# EAGLE design IO Board (EAGLE 9.5.0)

## Sheet 1 of 3: IO Control
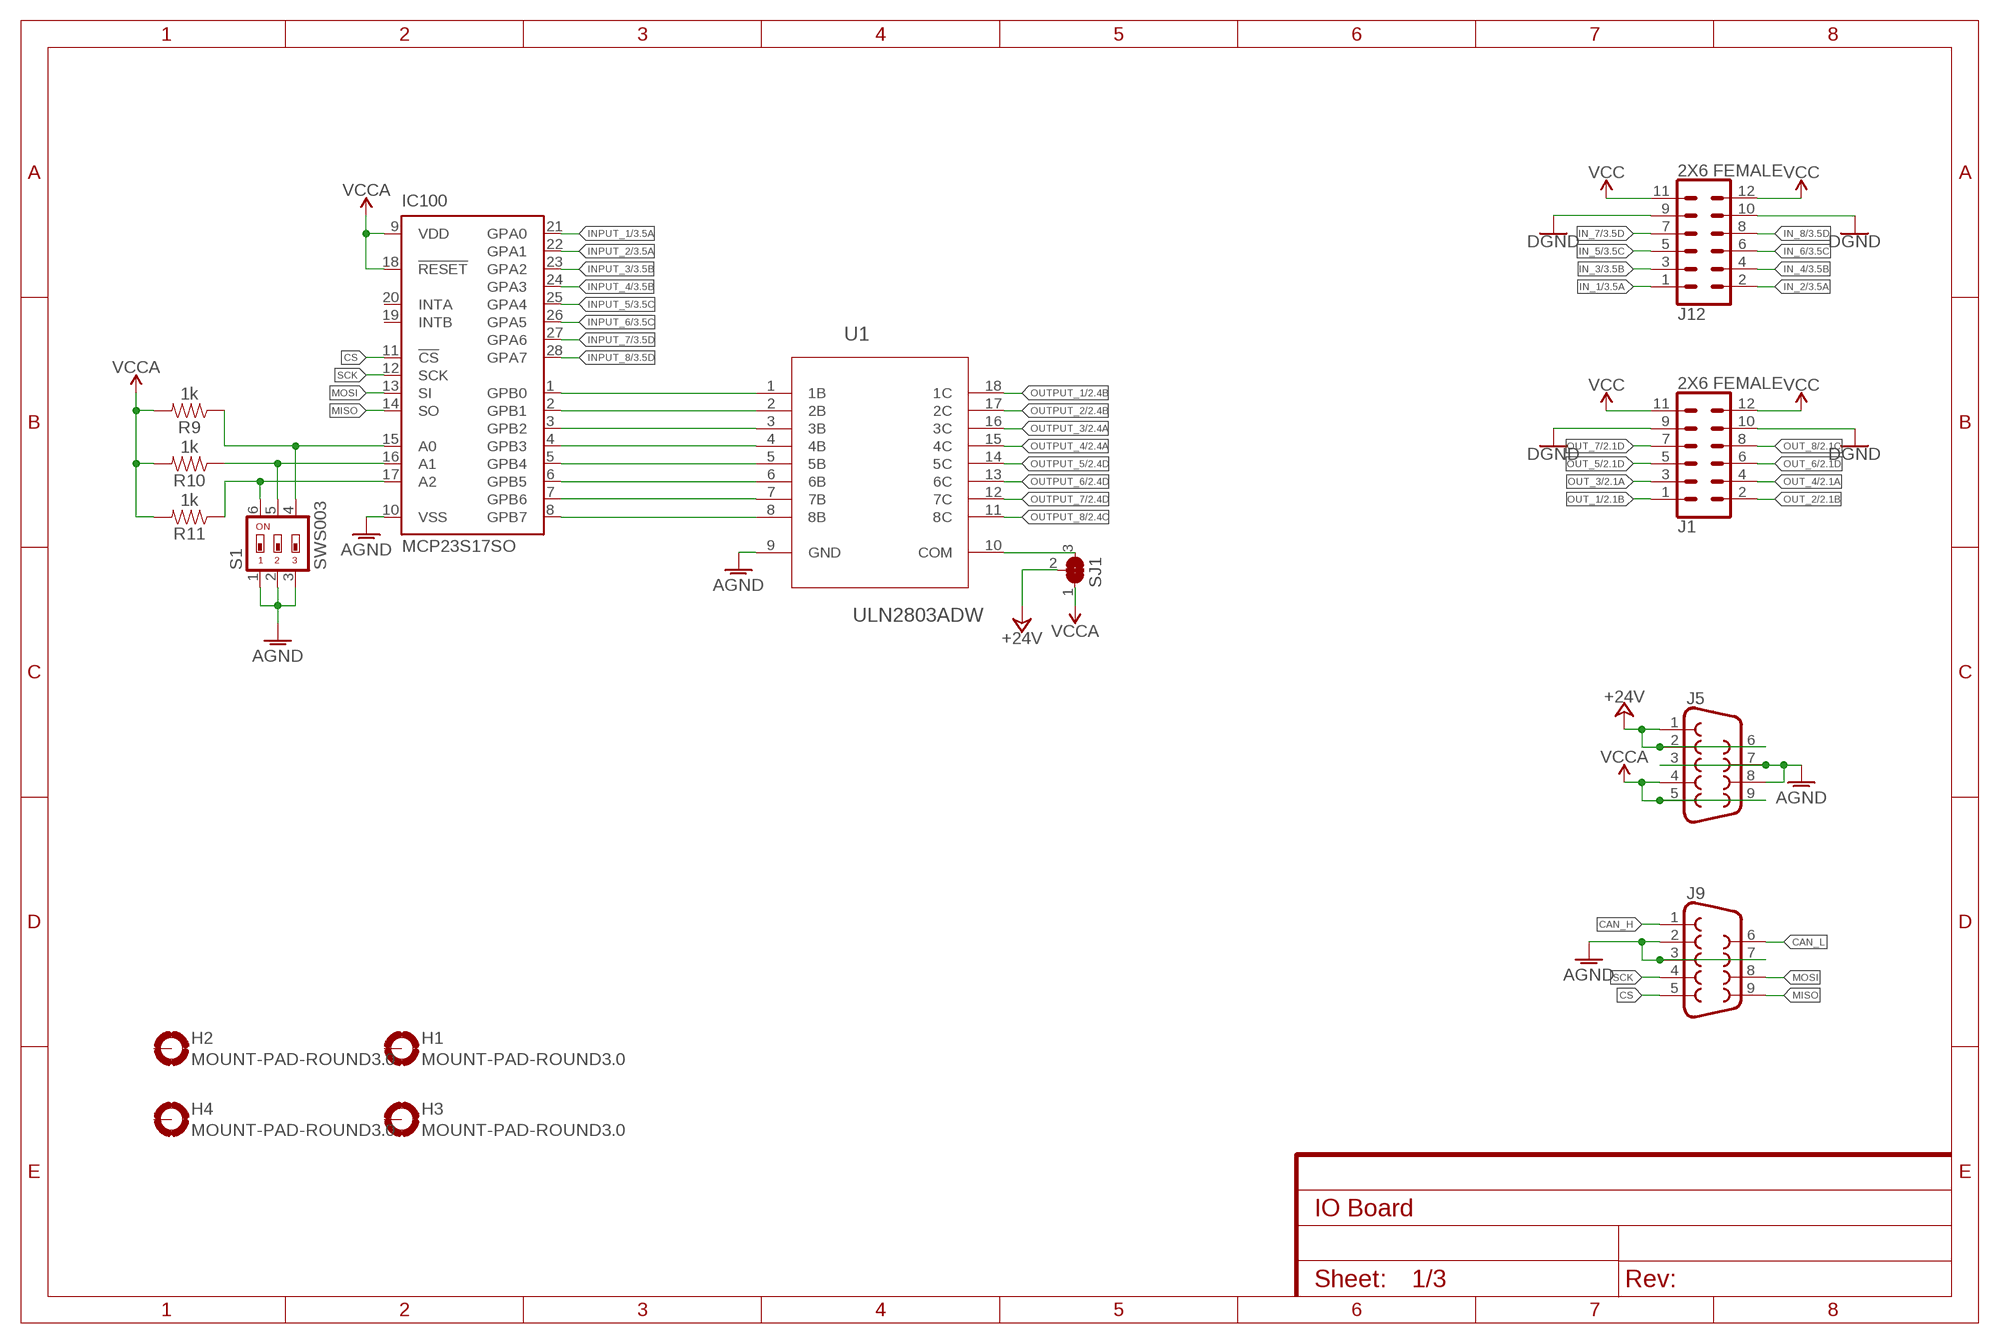
[diagram p0: schematic, sheet 1]

### Parts
H1  MOUNT-PAD-ROUND3.0  [3,0-PAD]
H2  MOUNT-PAD-ROUND3.0  [3,0-PAD]
H3  MOUNT-PAD-ROUND3.0  [3,0-PAD]
H4  MOUNT-PAD-ROUND3.0  [3,0-PAD]
IC100  MCP23S17SO  [SO28W]
J1  2X6 FEMALE  CONN_06X2PTH_FEMALE  [2X6]
J5  DB9FEMALE  [DB9]
J9  DB9FEMALE  [DB9]
J12  2X6 FEMALE  CONN_06X2PTH_FEMALE  [2X6]
R9  1k  RESISTOR0805  [0805]
R10  1k  RESISTOR0805  [0805]
R11  1k  RESISTOR0805  [0805]
S1  SWS003  [SMS-003]
SJ1  SOLDERJUMPER_2WAY  [SOLDERJUMPER_2WAY_OPEN_NOPASTE]
U1  ULN2803ADW  [SOIC127P1030X265-18N]

### Nets
+24V: J5.1 J5.2 J5.6 SJ1.2 ; also sheet 2
AGND: IC100.10(VSS) J5.3 J5.7 J5.8 J9.2 J9.3 J9.7 S1.1 S1.2 S1.3 U1.9(GND) ; also sheet 2,3
CAN_H: J9.1
CAN_L: J9.6
CS: IC100.11(!CS) J9.5
GND: J1.9 J1.10 J12.9 J12.10 ; supply symbol labelled DGND ; also sheet 2,3
IN_1: J12.1 ; also sheet 3
IN_2: J12.2 ; also sheet 3
IN_3: J12.3 ; also sheet 3
IN_4: J12.4 ; also sheet 3
IN_5: J12.5 ; also sheet 3
IN_6: J12.6 ; also sheet 3
IN_7: J12.7 ; also sheet 3
IN_8: J12.8 ; also sheet 3
INPUT_1: IC100.21(GPA0) ; also sheet 3
INPUT_2: IC100.22(GPA1) ; also sheet 3
INPUT_3: IC100.23(GPA2) ; also sheet 3
INPUT_4: IC100.24(GPA3) ; also sheet 3
INPUT_5: IC100.25(GPA4) ; also sheet 3
INPUT_6: IC100.26(GPA5) ; also sheet 3
INPUT_7: IC100.27(GPA6) ; also sheet 3
INPUT_8: IC100.28(GPA7) ; also sheet 3
MISO: IC100.14(SO) J9.9
MOSI: IC100.13(SI) J9.8
N$11: IC100.1(GPB0) U1.1(1B)
N$13: IC100.3(GPB2) U1.3(3B)
N$15: IC100.2(GPB1) U1.2(2B)
N$17: IC100.4(GPB3) U1.4(4B)
N$29: SJ1.3 U1.10(COM)
N$58: IC100.5(GPB4) U1.5(5B)
N$61: IC100.7(GPB6) U1.7(7B)
N$64: IC100.6(GPB5) U1.6(6B)
N$65: IC100.8(GPB7) U1.8(8B)
N$74: IC100.15(A0) R9.1 S1.4
N$75: IC100.16(A1) R10.1 S1.5
N$76: IC100.17(A2) R11.1 S1.6
OUT_1: J1.1 ; also sheet 2
OUT_2: J1.2 ; also sheet 2
OUT_3: J1.3 ; also sheet 2
OUT_4: J1.4 ; also sheet 2
OUT_5: J1.5 ; also sheet 2
OUT_6: J1.6 ; also sheet 2
OUT_7: J1.7 ; also sheet 2
OUT_8: J1.8 ; also sheet 2
OUTPUT_1: U1.18(1C) ; also sheet 2
OUTPUT_2: U1.17(2C) ; also sheet 2
OUTPUT_3: U1.16(3C) ; also sheet 2
OUTPUT_4: U1.15(4C) ; also sheet 2
OUTPUT_5: U1.14(5C) ; also sheet 2
OUTPUT_6: U1.13(6C) ; also sheet 2
OUTPUT_7: U1.12(7C) ; also sheet 2
OUTPUT_8: U1.11(8C) ; also sheet 2
SCK: IC100.12(SCK) J9.4
VCC: J1.11 J1.12 J12.11 J12.12 ; also sheet 3
VCCA: IC100.9(VDD) IC100.18(!RESET) J5.4 J5.5 J5.9 R9.2 R10.2 R11.2 SJ1.1 ; also sheet 2
Unconnected: H1.B3,0(MOUNT) H2.B3,0(MOUNT) H3.B3,0(MOUNT) H4.B3,0(MOUNT) IC100.19(INTB) IC100.20(INTA)

## Sheet 2 of 3: Outputs
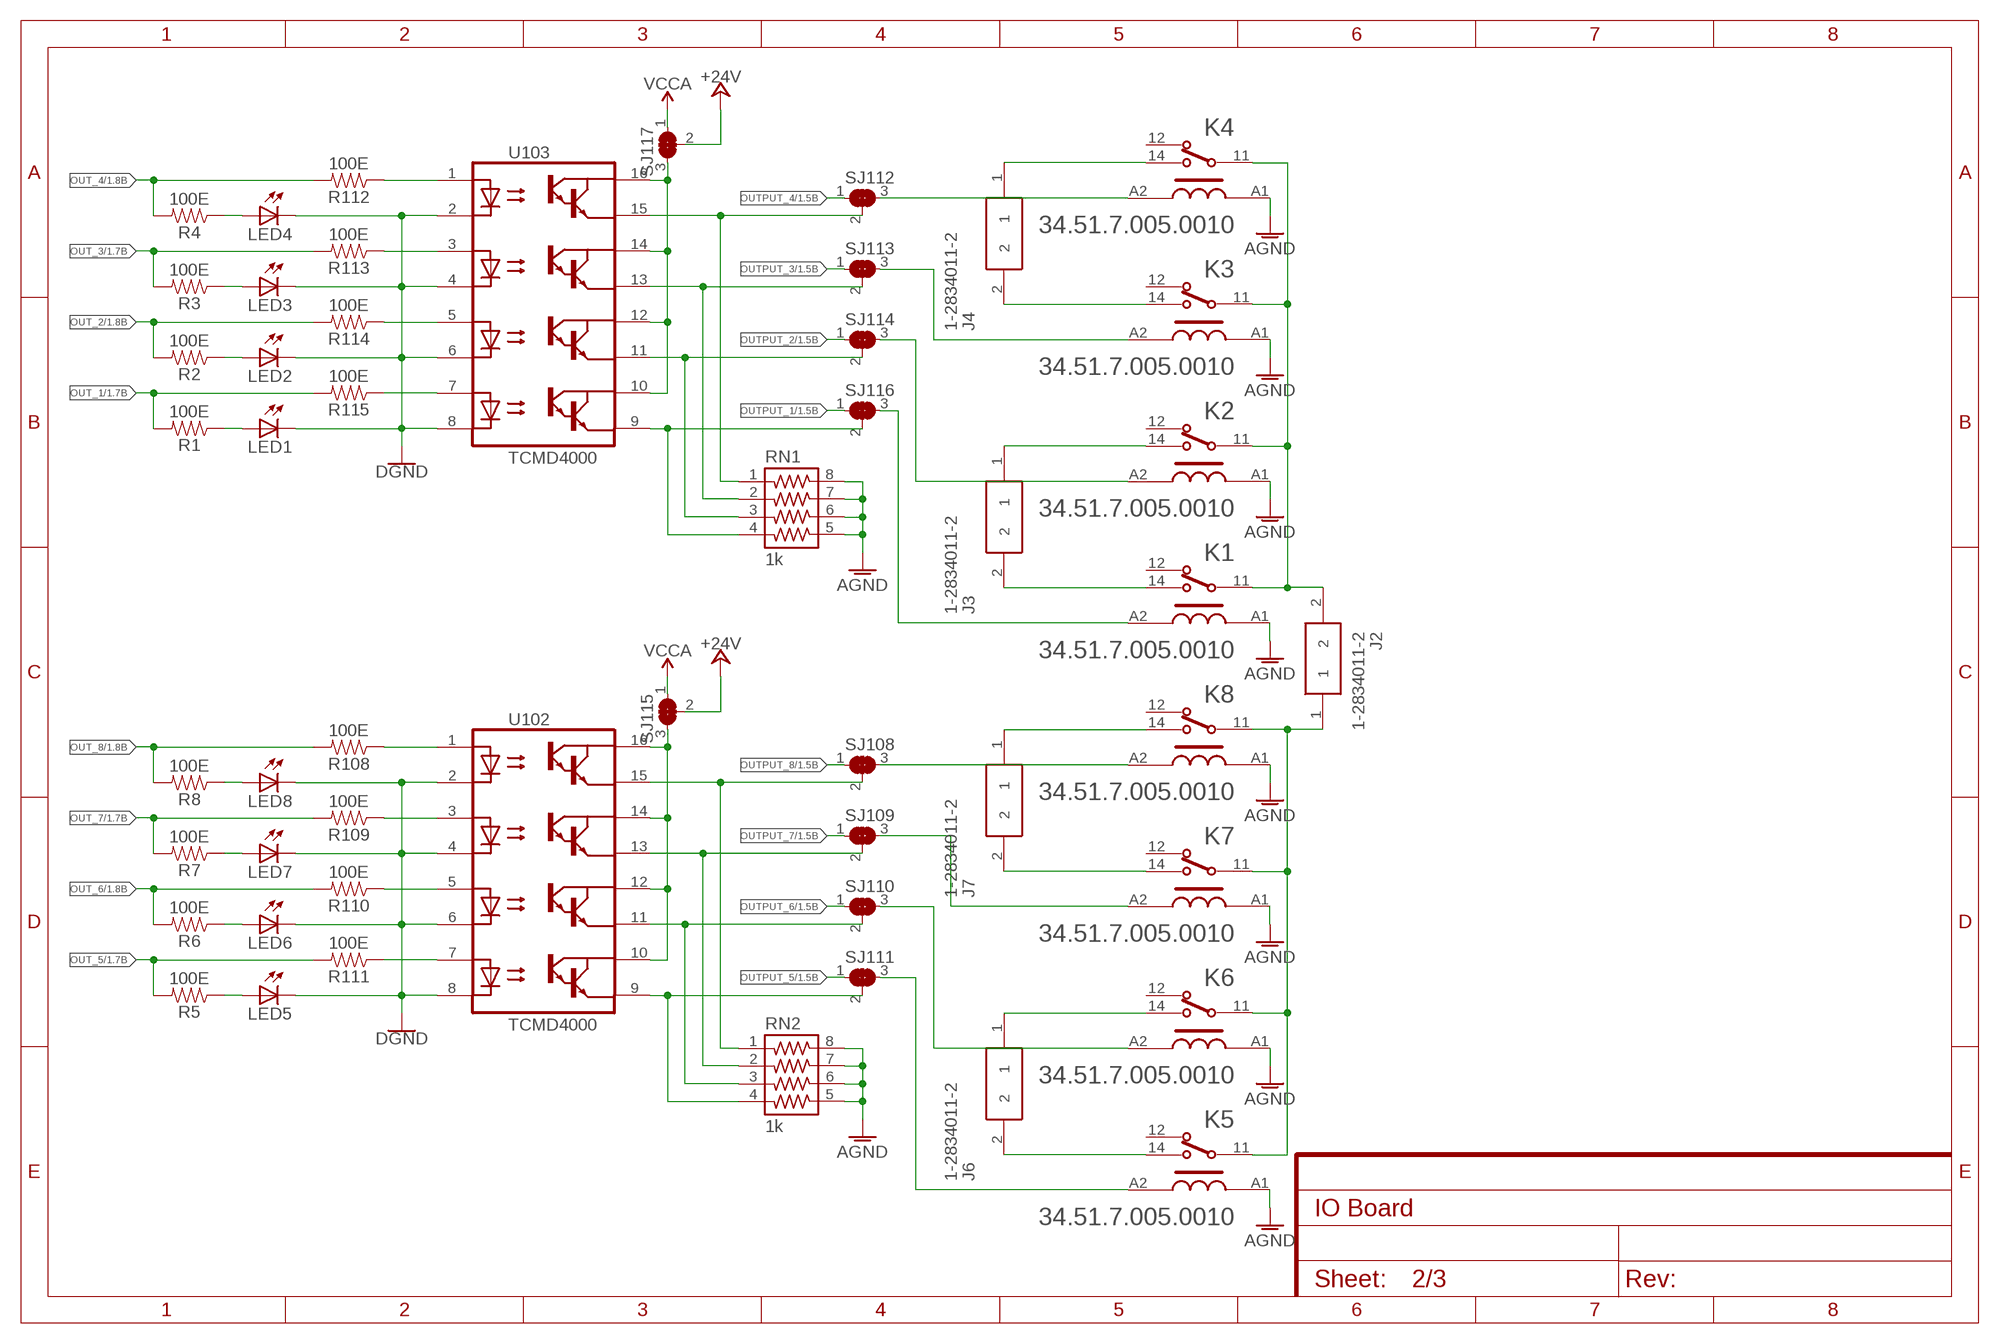
[diagram p1: schematic, sheet 2]

### Parts
J2  1-2834011-2  [128340112]
J3  1-2834011-2  [128340112]
J4  1-2834011-2  [128340112]
J6  1-2834011-2  [128340112]
J7  1-2834011-2  [128340112]
K1  FINDER_34.51.7.005.0010FINDER_34.51.7.005.0010_0_0  [FINDER_34.51.7.005.0010_0]
K2  FINDER_34.51.7.005.0010FINDER_34.51.7.005.0010_0_0  [FINDER_34.51.7.005.0010_0]
K3  FINDER_34.51.7.005.0010FINDER_34.51.7.005.0010_0_0  [FINDER_34.51.7.005.0010_0]
K4  FINDER_34.51.7.005.0010FINDER_34.51.7.005.0010_0_0  [FINDER_34.51.7.005.0010_0]
K5  FINDER_34.51.7.005.0010FINDER_34.51.7.005.0010_0_0  [FINDER_34.51.7.005.0010_0]
K6  FINDER_34.51.7.005.0010FINDER_34.51.7.005.0010_0_0  [FINDER_34.51.7.005.0010_0]
K7  FINDER_34.51.7.005.0010FINDER_34.51.7.005.0010_0_0  [FINDER_34.51.7.005.0010_0]
K8  FINDER_34.51.7.005.0010FINDER_34.51.7.005.0010_0_0  [FINDER_34.51.7.005.0010_0]
LED1  LEDCHIP-LED0805  [CHIP-LED0805]
LED2  LEDCHIP-LED0805  [CHIP-LED0805]
LED3  LEDCHIP-LED0805  [CHIP-LED0805]
LED4  LEDCHIP-LED0805  [CHIP-LED0805]
LED5  LEDCHIP-LED0805  [CHIP-LED0805]
LED6  LEDCHIP-LED0805  [CHIP-LED0805]
LED7  LEDCHIP-LED0805  [CHIP-LED0805]
LED8  LEDCHIP-LED0805  [CHIP-LED0805]
R1  100E  RESISTOR0805  [0805]
R2  100E  RESISTOR0805  [0805]
R3  100E  RESISTOR0805  [0805]
R4  100E  RESISTOR0805  [0805]
R5  100E  RESISTOR0805  [0805]
R6  100E  RESISTOR0805  [0805]
R7  100E  RESISTOR0805  [0805]
R8  100E  RESISTOR0805  [0805]
R108  100E  RESISTOR0805  [0805]
R109  100E  RESISTOR0805  [0805]
R110  100E  RESISTOR0805  [0805]
R111  100E  RESISTOR0805  [0805]
R112  100E  RESISTOR0805  [0805]
R113  100E  RESISTOR0805  [0805]
R114  100E  RESISTOR0805  [0805]
R115  100E  RESISTOR0805  [0805]
RN1  1k  743-8NS  [743-8NS]
RN2  1k  743-8NS  [743-8NS]
SJ108  SOLDERJUMPER_2WAY  [SOLDERJUMPER_2WAY_OPEN_NOPASTE]
SJ109  SOLDERJUMPER_2WAY  [SOLDERJUMPER_2WAY_OPEN_NOPASTE]
SJ110  SOLDERJUMPER_2WAY  [SOLDERJUMPER_2WAY_OPEN_NOPASTE]
SJ111  SOLDERJUMPER_2WAY  [SOLDERJUMPER_2WAY_OPEN_NOPASTE]
SJ112  SOLDERJUMPER_2WAY  [SOLDERJUMPER_2WAY_OPEN_NOPASTE]
SJ113  SOLDERJUMPER_2WAY  [SOLDERJUMPER_2WAY_OPEN_NOPASTE]
SJ114  SOLDERJUMPER_2WAY  [SOLDERJUMPER_2WAY_OPEN_NOPASTE]
SJ115  SOLDERJUMPER_2WAY  [SOLDERJUMPER_2WAY_OPEN_NOPASTE]
SJ116  SOLDERJUMPER_2WAY  [SOLDERJUMPER_2WAY_OPEN_NOPASTE]
SJ117  SOLDERJUMPER_2WAY  [SOLDERJUMPER_2WAY_OPEN_NOPASTE]
U102  TCMD4000  [SOIC127P686X201-16N]
U103  TCMD4000  [SOIC127P686X201-16N]

### Nets
+24V: SJ115.2 SJ117.2 ; also sheet 1
AGND: K1.A1 K2.A1 K3.A1 K4.A1 K5.A1 K6.A1 K7.A1 K8.A1 RN1.5 RN1.6 RN1.7 RN1.8 RN2.5 RN2.6 RN2.7 RN2.8 ; also sheet 1,3
GND: LED1.C LED2.C LED3.C LED4.C LED5.C LED6.C LED7.C LED8.C U102.2(C1) U102.4(C2) U102.6(C3) U102.8(C4) U103.2(C1) U103.4(C2) U103.6(C3) U103.8(C4) ; supply symbol labelled DGND ; also sheet 1,3
N$1: K3.A2 SJ113.3
N$2: RN1.3 SJ114.2 U103.11(E3)
N$3: RN1.4 SJ116.2 U103.9(E4)
N$4: K8.A2 SJ108.3
N$5: K7.A2 SJ109.3
N$6: RN2.3 SJ110.2 U102.11(E3)
N$7: RN2.4 SJ111.2 U102.9(E4)
N$8: K4.A2 SJ112.3
N$9: LED4.A R4.1
N$10: LED8.A R8.1
N$12: LED7.A R7.1
N$14: LED6.A R6.1
N$16: LED5.A R5.1
N$18: R108.1 U102.1(A1)
N$19: R109.1 U102.3(A2)
N$20: R110.1 U102.5(A3)
N$21: R111.1 U102.7(A4)
N$22: SJ115.3 U102.10(CO4) U102.12(CO3) U102.14(CO2) U102.16(CO1)
N$23: RN2.2 SJ109.2 U102.13(E2)
N$24: LED3.A R3.1
N$25: RN2.1 SJ108.2 U102.15(E1)
N$26: K5.A2 SJ111.3
N$27: J4.1 K4.14
N$28: J4.2 K3.14
N$33: J3.1 K2.14
N$37: LED2.A R2.1
N$38: LED1.A R1.1
N$39: J3.2 K1.14
N$40: J2.1 K5.11 K6.11 K7.11 K8.11
N$41: R112.1 U103.1(A1)
N$42: J7.1 K8.14
N$44: J2.2 K1.11 K2.11 K3.11 K4.11
N$45: K6.A2 SJ110.3
N$46: J7.2 K7.14
N$47: J6.1 K6.14
N$48: K2.A2 SJ114.3
N$49: R113.1 U103.3(A2)
N$50: R114.1 U103.5(A3)
N$51: R115.1 U103.7(A4)
N$52: SJ117.3 U103.10(CO4) U103.12(CO3) U103.14(CO2) U103.16(CO1)
N$53: RN1.2 SJ113.2 U103.13(E2)
N$54: RN1.1 SJ112.2 U103.15(E1)
N$55: K1.A2 SJ116.3
N$57: J6.2 K5.14
OUT_1: R1.2 R115.2 ; also sheet 1
OUT_2: R2.2 R114.2 ; also sheet 1
OUT_3: R3.2 R113.2 ; also sheet 1
OUT_4: R4.2 R112.2 ; also sheet 1
OUT_5: R5.2 R111.2 ; also sheet 1
OUT_6: R6.2 R110.2 ; also sheet 1
OUT_7: R7.2 R109.2 ; also sheet 1
OUT_8: R8.2 R108.2 ; also sheet 1
OUTPUT_1: SJ116.1 ; also sheet 1
OUTPUT_2: SJ114.1 ; also sheet 1
OUTPUT_3: SJ113.1 ; also sheet 1
OUTPUT_4: SJ112.1 ; also sheet 1
OUTPUT_5: SJ111.1 ; also sheet 1
OUTPUT_6: SJ110.1 ; also sheet 1
OUTPUT_7: SJ109.1 ; also sheet 1
OUTPUT_8: SJ108.1 ; also sheet 1
VCCA: SJ115.1 SJ117.1 ; also sheet 1
Unconnected: K1.12 K2.12 K3.12 K4.12 K5.12 K6.12 K7.12 K8.12

## Sheet 3 of 3: Inputs
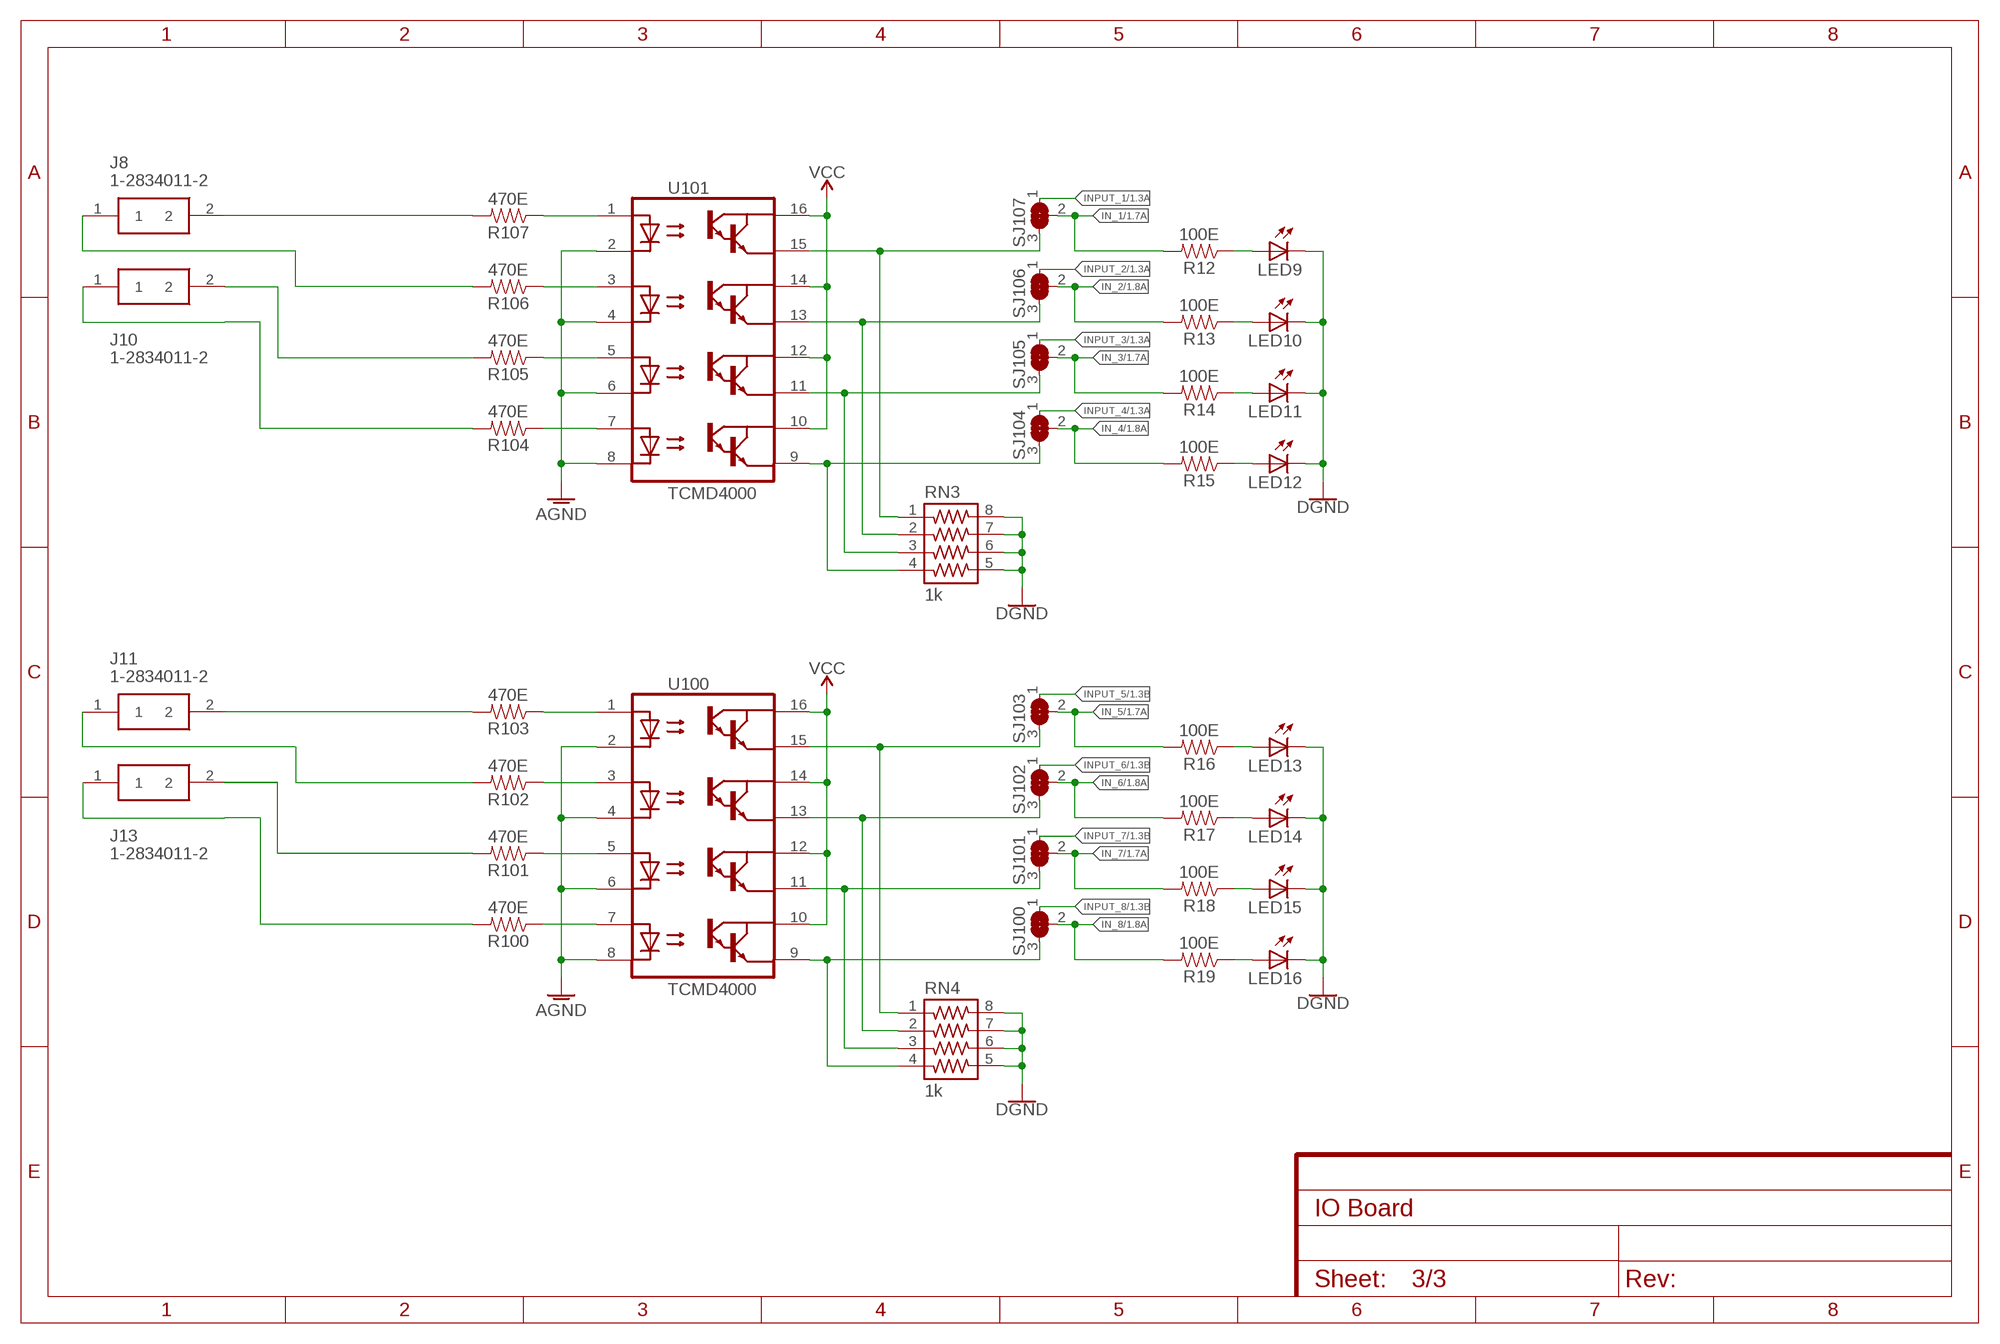
[diagram p2: schematic, sheet 3]

### Parts
J8  1-2834011-2  [128340112]
J10  1-2834011-2  [128340112]
J11  1-2834011-2  [128340112]
J13  1-2834011-2  [128340112]
LED9  LEDCHIP-LED0805  [CHIP-LED0805]
LED10  LEDCHIP-LED0805  [CHIP-LED0805]
LED11  LEDCHIP-LED0805  [CHIP-LED0805]
LED12  LEDCHIP-LED0805  [CHIP-LED0805]
LED13  LEDCHIP-LED0805  [CHIP-LED0805]
LED14  LEDCHIP-LED0805  [CHIP-LED0805]
LED15  LEDCHIP-LED0805  [CHIP-LED0805]
LED16  LEDCHIP-LED0805  [CHIP-LED0805]
R12  100E  RESISTOR0805  [0805]
R13  100E  RESISTOR0805  [0805]
R14  100E  RESISTOR0805  [0805]
R15  100E  RESISTOR0805  [0805]
R16  100E  RESISTOR0805  [0805]
R17  100E  RESISTOR0805  [0805]
R18  100E  RESISTOR0805  [0805]
R19  100E  RESISTOR0805  [0805]
R100  470E  RESISTOR0805  [0805]
R101  470E  RESISTOR0805  [0805]
R102  470E  RESISTOR0805  [0805]
R103  470E  RESISTOR0805  [0805]
R104  470E  RESISTOR0805  [0805]
R105  470E  RESISTOR0805  [0805]
R106  470E  RESISTOR0805  [0805]
R107  470E  RESISTOR0805  [0805]
RN3  1k  743-8NS  [743-8NS]
RN4  1k  743-8NS  [743-8NS]
SJ100  SOLDERJUMPER_2WAY  [SOLDERJUMPER_2WAY_OPEN_NOPASTE]
SJ101  SOLDERJUMPER_2WAY  [SOLDERJUMPER_2WAY_OPEN_NOPASTE]
SJ102  SOLDERJUMPER_2WAY  [SOLDERJUMPER_2WAY_OPEN_NOPASTE]
SJ103  SOLDERJUMPER_2WAY  [SOLDERJUMPER_2WAY_OPEN_NOPASTE]
SJ104  SOLDERJUMPER_2WAY  [SOLDERJUMPER_2WAY_OPEN_NOPASTE]
SJ105  SOLDERJUMPER_2WAY  [SOLDERJUMPER_2WAY_OPEN_NOPASTE]
SJ106  SOLDERJUMPER_2WAY  [SOLDERJUMPER_2WAY_OPEN_NOPASTE]
SJ107  SOLDERJUMPER_2WAY  [SOLDERJUMPER_2WAY_OPEN_NOPASTE]
U100  TCMD4000  [SOIC127P686X201-16N]
U101  TCMD4000  [SOIC127P686X201-16N]

### Nets
AGND: U100.2(C1) U100.4(C2) U100.6(C3) U100.8(C4) U101.2(C1) U101.4(C2) U101.6(C3) U101.8(C4) ; also sheet 1,2
GND: LED9.C LED10.C LED11.C LED12.C LED13.C LED14.C LED15.C LED16.C RN3.5 RN3.6 RN3.7 RN3.8 RN4.5 RN4.6 RN4.7 RN4.8 ; supply symbol labelled DGND ; also sheet 1,2
IN_1: R12.2 SJ107.2 ; also sheet 1
IN_2: R13.2 SJ106.2 ; also sheet 1
IN_3: R14.2 SJ105.2 ; also sheet 1
IN_4: R15.2 SJ104.2 ; also sheet 1
IN_5: R16.2 SJ103.2 ; also sheet 1
IN_6: R17.2 SJ102.2 ; also sheet 1
IN_7: R18.2 SJ101.2 ; also sheet 1
IN_8: R19.2 SJ100.2 ; also sheet 1
INPUT_1: SJ107.1 ; also sheet 1
INPUT_2: SJ106.1 ; also sheet 1
INPUT_3: SJ105.1 ; also sheet 1
INPUT_4: SJ104.1 ; also sheet 1
INPUT_5: SJ103.1 ; also sheet 1
INPUT_6: SJ102.1 ; also sheet 1
INPUT_7: SJ101.1 ; also sheet 1
INPUT_8: SJ100.1 ; also sheet 1
N$30: LED9.A R12.1
N$31: LED10.A R13.1
N$32: LED11.A R14.1
N$34: LED12.A R15.1
N$35: R107.1 U101.1(A1)
N$36: R106.1 U101.3(A2)
N$43: J8.1 R106.2
N$56: J13.2 R101.2
N$73: R105.1 U101.5(A3)
N$77: R104.1 U101.7(A4)
N$78: LED13.A R16.1
N$79: RN3.2 SJ106.3 U101.13(E2)
N$80: RN3.1 SJ107.3 U101.15(E1)
N$81: LED14.A R17.1
N$82: LED15.A R18.1
N$83: LED16.A R19.1
N$85: R103.1 U100.1(A1)
N$86: R102.1 U100.3(A2)
N$87: R101.1 U100.5(A3)
N$88: R100.1 U100.7(A4)
N$89: RN4.2 SJ102.3 U100.13(E2)
N$90: RN4.1 SJ103.3 U100.15(E1)
N$91: RN4.3 SJ101.3 U100.11(E3)
N$92: RN4.4 SJ100.3 U100.9(E4)
N$93: J8.2 R107.2
N$95: J10.2 R105.2
N$96: J10.1 R104.2
N$97: RN3.3 SJ105.3 U101.11(E3)
N$98: RN3.4 SJ104.3 U101.9(E4)
N$99: J11.2 R103.2
N$100: J11.1 R102.2
N$101: J13.1 R100.2
VCC: U100.10(CO4) U100.12(CO3) U100.14(CO2) U100.16(CO1) U101.10(CO4) U101.12(CO3) U101.14(CO2) U101.16(CO1) ; also sheet 1

## Library data of the parts
H1-H4 = holes:MOUNT-PAD-ROUND: MOUNTING PAD, round
IC100 = microchip:MCP23S17: http://ww1.microchip.com/downloads/en/DeviceDoc/21952a.pdf Source: http://ww1.microchip.com/downloads/en/DeviceDoc/21952a.pdf; MF: MICROCHIP; MPN: MCP23S17-E/SO; OC_FARNELL: unknown; OC_NEWARK: 31K2950
J1 J12 = SparkFun-Connectors:CONN_06X2: Multi connection point. Often used as Generic Header-pin footprint for 0.1 inch spaced/style header connections On any of the 0.1 inch spaced packages, you can populate with these: Break Away Headers - Straight <https://www.sparkfun.com/products/116> (PRT-00116) Break Away Male Headers - Right Angle <https://www.sparkfun.com/products/553> (PRT-00553) Female Headers <https://www.sparkfun.com/products/115> (PRT-00115) Break Away Headers - Machine Pin <https://www.sparkfun.com/products/117> (PRT-00117) Break Away Female Headers - Swiss Machine Pin <https://www.sparkfun.com/products/743> (PRT-00743); PROD_ID: CONN-12423
J2-J4 J6-J8 J10 J11 J13 = 1-2834011-2:1-2834011-2: 2P 3.5mm Top Entry Screwless Connector. TE Connectivity 3.5mm Pitch Vertical PCB Terminal Block with Solder Termination, Through Hole, 2 Way Source: Datasheet <http://www.te.com/commerce/DocumentDelivery/DDEController?Action=showdoc&DocId=Customer Drawing2834011BpdfEnglishENG_CD_2834011_B.pdf1-2834011-2>; ARROW_PART_NUMBER: 1-2834011-2; ARROW_PRICE/STOCK: https://www.arrow.com/en/products/1-2834011-2/te-connectivity; DESCRIPTION: 2P 3.5mm Top Entry Screwless Connector. TE Connectivity 3.5mm Pitch Vertical PCB Terminal Block with Solder Termination, Through Hole, 2 Way; HEIGHT: 11mm; MANUFACTURER_NAME: TE Connectivity; MANUFACTURER_PART_NUMBER: 1-2834011-2; RS_PART_NUMBER: 1649131; RS_PRICE/STOCK: http://uk.rs-online.com/web/p/products/1649131
J5 J9 = SparkFun-Connectors:DB9: DB9 Connector Standard DB9 (D-Sub 9) serial connector. Can be used for CAN bus as well as RS485 and RS232. Footprint production proven. Here is the female version connector we sell at SparkFun: 9 Pin Female Serial Connector - PCB Mount <https://www.sparkfun.com/products/429> (PRT-00429) This connector has been used on the following SparkFun products: SparkFun RS232 Shifter - SMD <https://www.sparkfun.com/products/449> (PRT-00449) SparkFun RS232 Shifter SMD (No DB9) <https://www.sparkfun.com/products/8780> (PRT-08780); PROD_ID: CONN-08194
K1-K8 = Finder - 34.51.7.005.0010:FINDER_34.51.7.005.0010: General Purpose Relay, 34 Series, Power, SPDT, 5 VDC, 6 A; AMBIENT_TEMPERATURE_RANGE_HIGH: +85°C; AMBIENT_TEMPERATURE_RANGE_LOW: -40°C; CENTROID_NOT_SPECIFIED: No; COIL_CURRENT: 38.4mA; COIL_POWER: 170mW; COIL_RESISTANCE: 130Ω; COIL_TYPE: Non-Latching; CURRENT_RATING: 6A; DATASHEET: https://gfinder.findernet.com/public/attachments/34/EN/S34EN.pdf; DEVICE_CLASS_L1: Electromechanical; DEVICE_CLASS_L2: Relays; DEVICE_CLASS_L3: Power Relays; FOOTPRINT_PARAMETERS_0: {"fp_type":"Axial","params":{"N":{"long name":"Number of leads","type":"fixed","short name":"N","value":2},"L":{"nom":false,"long name":"Package length","min":5791200,"max":6807200,"short name":"L","type":"measurement"},"D":{"nom":false,"long name":"Package diameter","min":2209800,"max":2590800,"short name":"D","type":"measurement"},"d":{"nom":false,"long name":"Lead diameter","min":508000,"max":609600,"short name":"d","type":"measurement"},"e":{"nom":10160000,"long name":"Lead spacing","min":null,"max":null,"short name":"e","type":"measurement"},"P":{"default":"false","long name":"Polarized","type":"multichoice","short name":"P"},"offset x":{"nom":0,"long name":"X Center offset","min":null,"max":null,"short name":"offset x","type":"measurement"},"offset y":{"nom":0,"long name":"Y Center offset","min":null,"max":null,"short name":"offset y","type":"measurement"},"LS":{"default":"Circle","long name":"Land shape","type":"multichoice","short name":"LS"},"LS1":{"default":"Square","long name":"Land shape (Pin 1)","type":"multichoice","short name":"LS1"}}}; HEIGHT: 15mm; IPC_LAND_PATTERN_NAME: CAPAD1016W80L630D240; LEAD_FREE: yes; MF: Finder; MFG_PACKAGE_IDENT: 34.51; MFG_PACKAGE_IDENT_DATE: 0; MFG_PACKAGE_IDENT_REV: 0; MPN: 34.51.7.005.0010; NUMBER_OF_CONTACTS: 1; PACKAGE: RELAY_PTH_28MM00_5MM00; PREFIX: K; ROHS: yes; THROW_CONFIGURATION: SPDT; VERIFICATION_VERSION: 0.0.0.1; VOLTAGE_RATING_AC: 250V
LED1-LED16 = adafruit:LED: LED OSRAM: - CHIPLED LG R971, LG N971, LY N971, LG Q971, LY Q971, LO R971, LY R971 LH N974, LH R974 LS Q976, LO Q976, LY Q976 LO Q996 - Hyper CHIPLED LW Q18S LB Q993, LB Q99A, LB R99A - SideLED LS A670, LO A670, LY A670, LG A670, LP A670 LB A673, LV A673, LT A673, LW A673 LH A674 LY A675 LS A676, LA A676, LO A676, LY A676, LW A676 LS A679, LY A679, LG A679 - Hyper Micro SIDELED® LS Y876, LA Y876, LO Y876, LY Y876 LT Y87S - SmartLED LW L88C, LW L88S LB L89C, LB L89S, LG L890 LS L89K, LO L89K, LY L89K LS L896, LA L896, LO L896, LY L896 - TOPLED LS T670, LO T670, LY T670, LG T670, LP T670 LSG T670, LSP T670, LSY T670, LOP T670, LYG T670 LG T671, LOG T671, LSG T671 LB T673, LV T673, LT T673, LW T673 LH T674 LS T676, LA T676, LO T676, LY T676, LB T676, LH T676, LSB T676, LW T676 LB T67C, LV T67C, LT T67C, LS T67K, LO T67K, LY T67K, LW E67C LS E67B, LA E67B, LO E67B, LY E67B, LB E67C, LV E67C, LT E67C LW T67C LS T679, LY T679, LG T679 LS T770, LO T770, LY T770, LG T770, LP T770 LB T773, LV T773, LT T773, LW T773 LH T774 LS E675, LA E675, LY E675, LS T675 LS T776, LA T776, LO T776, LY T776, LB T776 LHGB T686 LT T68C, LB T68C - Hyper Mini TOPLED® LB M676 - Mini TOPLED Santana® LG M470 LS M47K, LO M47K, LY M47K Source: http://www.osram.convergy.de/
R1-R19 R100-R115 = SparkFun-Resistors:RESISTOR: Generic Resistor Package
RN1-RN4 = resistor-array:743-8: CTS 743 Series 8 Terminations, 4 Resistors
S1 = smd-special:SWS003: SMD Dip Switch 3 pol.
SJ1 SJ100-SJ117 = microbuilder:SOLDERJUMPER_2WAY: 2-Way Solder Jumper
U1 = Texas Instruments_By_element14_Batch_1:ULN2803ADW: Darlington transistor array; MPN: ULN2803ADW; OC_FARNELL: 1652419; OC_NEWARK: 69K0711; PACKAGE: SOIC-18; SUPPLIER: TEXAS INSTRUMENTS
U100-U103 = TCMD4000:TCMD4000: Optocoupler, Photodarlington Output, High Gain, Single/Quad Channel, Half Pitch Mini-Flat Package; AVAILABILITY: Good; DESCRIPTION: TCMD4000 Series Quad Channel 35V 3750 Vrms Photodarlington Optocoupler - SOIC-16; MF: Vishay Semiconductor; MP: TCMD4000; PACKAGE: SOP-16 Vishay Semiconductor; PRICE: 1.38 USD

## Board
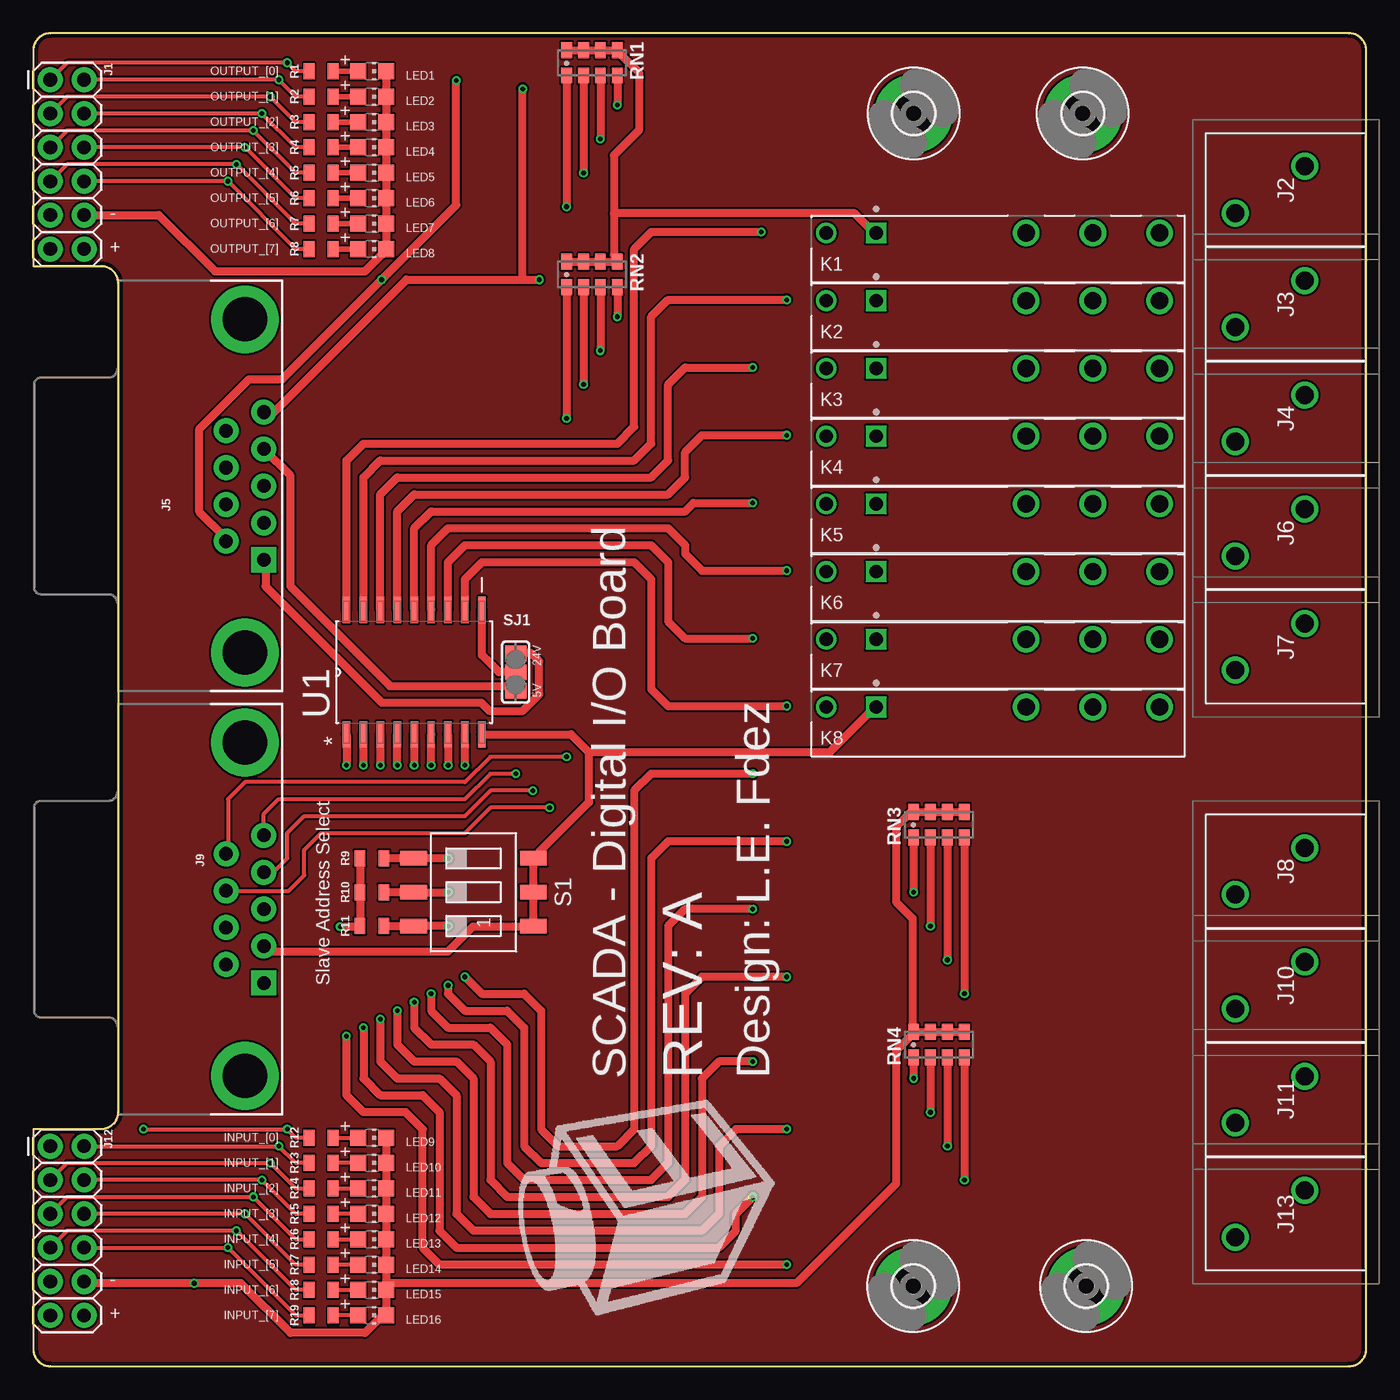
[diagram p3: board, top side]
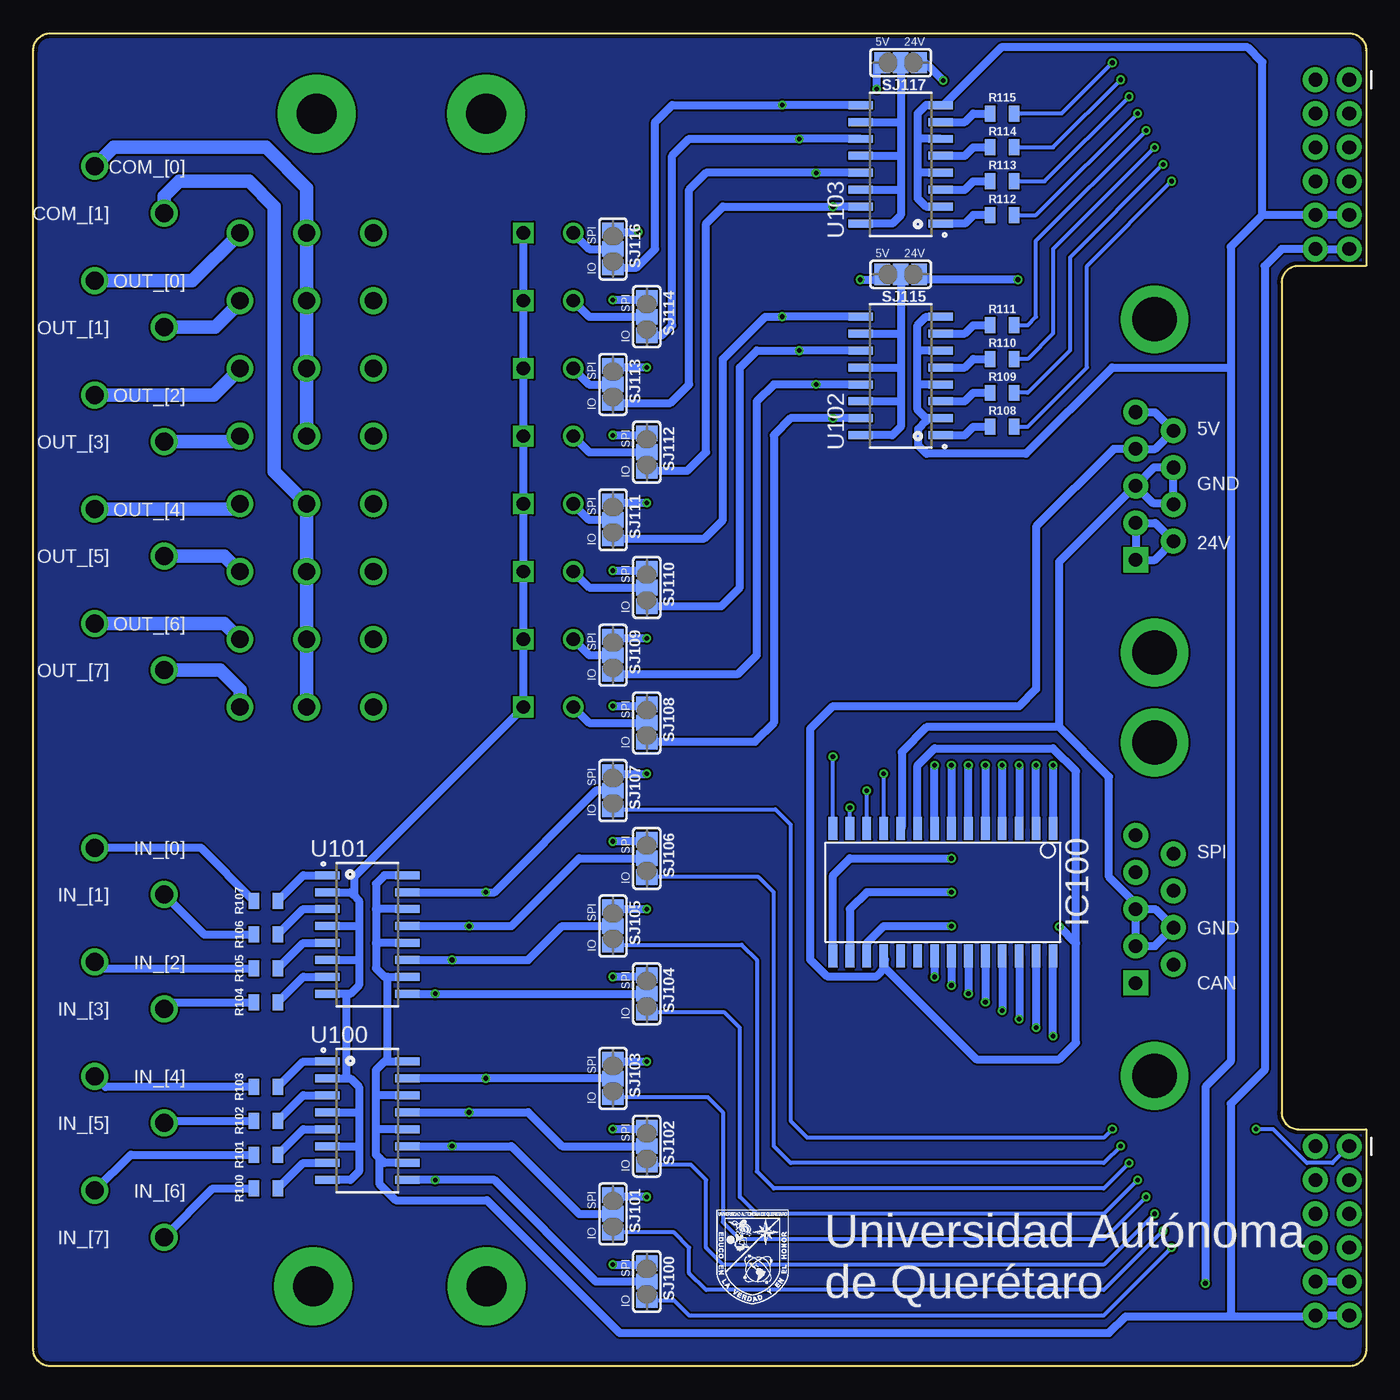
[diagram p4: board, bottom side, seen from below]

Size 100 x 100 mm. Coordinates in mm from the lower left corner, seen from the top.
Outline: 0,17.78 0,1.27 arc90 1.27,0 98.73,0 arc90 100,1.27 100,98.73 arc90 98.73,100 1.27,100 arc90 0,98.73 0,82.55 5.08,82.55 arc-90 6.35,81.28 6.35,19.05 arc-90 5.08,17.78 0,17.78
Copper layers (1*16): Top 0.035mm / dielectric 1.5mm / Bottom 0.035mm
Design rules "SeeedStudio_2layer_DRU_no_angle_20140221": minimum track width 6mil, minimum drill 12mil, track to track 6mil, track to pad 6mil, pad to pad 6mil, via to via 6mil, smd to smd 0mil, copper to edge 10mil, drill to drill 10mil, minimum pad ring 10mil, minimum via ring 6mil, stop-mask expansion 2mil, vias tented up to drill 100mil, thermal gap 10mil

### Footprints (pad centres in the part's own frame; a part is rotated, then mirrored left to right if it is on the bottom)
3,0-PAD = drill 3 pad 5.842: B3,0 0,0
SO28W = smd 0.65 x 1.7: 1 -7.62,-4.78; 2 -6.35,-4.78; 3 -5.08,-4.78; 4 -3.81,-4.78; 5 -2.54,-4.78; 6 -1.27,-4.78; 7 0,-4.78; 8 1.27,-4.78; 9 2.54,-4.78; 10 3.81,-4.78; 11 5.08,-4.78; 12 6.35,-4.78; 13 7.62,-4.78; 14 8.89,-4.78; 15 8.89,4.78; 16 7.62,4.78; 17 6.35,4.78; 18 5.08,4.78; 19 3.81,4.78; 20 2.54,4.78; 21 1.27,4.78; 22 0,4.78; 23 -1.27,4.78; 24 -2.54,4.78; 25 -3.81,4.78; 26 -5.08,4.78; 27 -6.35,4.78; 28 -7.62,4.78
2X6 = drill 1.016 pad 1.88: 1 0,0; 2 0,2.54; 3 2.54,0; 4 2.54,2.54; 5 5.08,0; 6 5.08,2.54; 7 7.62,0; 8 7.62,2.54; 9 10.16,0; 10 10.16,2.54; 11 12.7,0; 12 12.7,2.54
128340112 = drill 1.35 pad 2.025: 1 -1.75,3.8; 2 1.75,-1.4
DB9 = drill 1.016 pad 1.88 square: 1 -5.54,-1.42 | drill 1.016 pad 1.88: 2 -2.77,-1.42; 3 0,-1.42; 4 2.77,-1.42; 5 5.54,-1.42; 6 -4.15,1.42; 7 -1.38,1.42; 8 1.38,1.42; 9 4.15,1.42 | drill 3.302 pad 5.08: G1 -12.5,0; G2 12.5,0
FINDER_34.51.7.005.0010_0 = drill 1.3 pad 2: 11 7.1,1.2; 12 2.1,1.2; 14 12.1,1.2 | drill 1 pad 1.55 square: A1 -9.15,1.2 | drill 1 pad 1.55: A2 -12.9,1.2
CHIP-LED0805 = smd 1.2 x 1.2: A 0,-1.05; C 0,1.05
0805 = smd 0.8 x 1.2: 1 -0.9,0; 2 0.9,0
743-8NS = smd 0.8 x 1.2: 1 -1.905,-0.953; 2 -0.635,-0.953; 3 0.635,-0.953; 4 1.905,-0.953; 5 1.905,0.953; 6 0.635,0.953; 7 -0.635,0.953; 8 -1.905,0.953
SMS-003 = smd 1.092 x 2.007: 1 -2.54,-4.496; 2 0,-4.496; 3 2.54,-4.496; 4 2.54,4.496; 5 0,4.496; 6 -2.54,4.496
SOLDERJUMPER_2WAY_OPEN_NOPASTE = smd 1.168 x 1.6: 1 -1.397,0; 2 1.397,0; 3 0,0
SOIC127P1030X265-18N = smd 1.981 x 0.559: 1 -4.674,5.08; 2 -4.674,3.81; 3 -4.674,2.54; 4 -4.674,1.27; 5 -4.674,0; 6 -4.674,-1.27; 7 -4.674,-2.54; 8 -4.674,-3.81; 9 -4.674,-5.08; 10 4.674,-5.08; 11 4.674,-3.81; 12 4.674,-2.54; 13 4.674,-1.27; 14 4.674,0; 15 4.674,1.27; 16 4.674,2.54; 17 4.674,3.81; 18 4.674,5.08
SOIC127P686X201-16N = smd 1.82 x 0.6: 1 -3,4.445; 2 -3,3.175; 3 -3,1.905; 4 -3,0.635; 5 -3,-0.635; 6 -3,-1.905; 7 -3,-3.175; 8 -3,-4.445; 9 3,-4.445; 10 3,-3.175; 11 3,-1.905; 12 3,-0.635; 13 3,0.635; 14 3,1.905; 15 3,3.175; 16 3,4.445

### Placement (x,y rotation side)
H1  66.04,93.98 0 top
H2  78.74,93.98 0 top
H3  66,6 0 top
H4  79,6 0 top
IC100  31.11,35.56 180 bottom
J1  1.27,96.52 270 top
J2  93.98,88.27 90 top
J3  93.98,79.69 90 top
J4  93.98,71.12 90 top
J5  15.88,66.04 90 top
J6  93.98,62.55 90 top
J7  93.98,53.98 90 top
J8  93.98,37.15 90 top
J9  15.88,34.29 90 top
J10  93.98,28.57 90 top
J11  93.98,20 90 top
J12  1.27,16.51 270 top
J13  93.98,11.43 90 top
K1  72.39,83.82 0 top
K2  72.39,78.74 0 top
K3  72.39,73.66 0 top
K4  72.39,68.58 0 top
K5  72.39,63.5 0 top
K6  72.39,58.42 0 top
K7  72.39,53.34 0 top
K8  72.39,48.26 0 top
LED1  25.4,97.16 270 top
LED2  25.4,95.25 270 top
LED3  25.4,93.34 270 top
LED4  25.4,91.44 270 top
LED5  25.4,89.53 270 top
LED6  25.4,87.63 270 top
LED7  25.4,85.72 270 top
LED8  25.4,83.82 270 top
LED9  25.4,17.14 270 top
LED10  25.4,15.24 270 top
LED11  25.4,13.34 270 top
LED12  25.4,11.43 270 top
LED13  25.4,9.53 270 top
LED14  25.4,7.62 270 top
LED15  25.4,5.71 270 top
LED16  25.4,3.81 270 top
R1  21.59,97.16 180 top
R2  21.59,95.25 180 top
R3  21.59,93.34 180 top
R4  21.59,91.44 180 top
R5  21.59,89.53 180 top
R6  21.59,87.63 180 top
R7  21.59,85.72 180 top
R8  21.59,83.82 180 top
R9  25.4,38.1 180 top
R10  25.4,35.56 180 top
R11  25.4,33.02 180 top
R12  21.59,17.14 180 top
R13  21.59,15.24 180 top
R14  21.59,13.34 180 top
R15  21.59,11.43 180 top
R16  21.59,9.53 180 top
R17  21.59,7.62 180 top
R18  21.59,5.71 180 top
R19  21.59,3.81 180 top
R100  82.55,13.34 180 bottom
R101  82.55,15.88 180 bottom
R102  82.55,18.41 180 bottom
R103  82.55,20.95 180 bottom
R104  82.55,27.3 180 bottom
R105  82.55,29.84 180 bottom
R106  82.55,32.38 180 bottom
R107  82.55,34.92 180 bottom
R108  27.3,70.48 0 bottom
R109  27.3,73.03 0 bottom
R110  27.3,75.56 0 bottom
R111  27.3,78.11 0 bottom
R112  27.3,86.36 0 bottom
R113  27.3,88.9 0 bottom
R114  27.3,91.44 0 bottom
R115  27.3,93.98 0 bottom
RN1  41.91,97.79 0 top
RN2  41.91,81.92 0 top
RN3  67.94,40.64 0 top
RN4  67.94,24.13 0 top
S1  33.02,35.56 90 top
SJ1  36.2,52.07 90 top
SJ100  53.98,6.35 270 bottom
SJ101  56.52,11.43 270 bottom
SJ102  53.98,16.51 270 bottom
SJ103  56.52,21.59 270 bottom
SJ104  53.98,27.94 270 bottom
SJ105  56.52,33.02 270 bottom
SJ106  53.98,38.1 270 bottom
SJ107  56.52,43.18 270 bottom
SJ108  53.98,48.26 270 bottom
SJ109  56.52,53.34 270 bottom
SJ110  53.98,58.42 270 bottom
SJ111  56.52,63.5 270 bottom
SJ112  53.98,68.58 270 bottom
SJ113  56.52,73.66 270 bottom
SJ114  53.98,78.74 270 bottom
SJ115  34.92,81.92 0 bottom
SJ116  56.52,83.82 270 bottom
SJ117  34.92,97.79 0 bottom
U1  28.57,52.07 90 top
U100  74.93,18.41 0 bottom
U101  74.93,32.38 0 bottom
U102  34.92,74.3 180 bottom
U103  34.92,90.17 180 bottom

### Tracks (layer width: path | path; a pad name or v marks a point on that pad's centre or on a via)
+24V  (via drill 0.35)
  Top 0.61: J5.6 14.31,62.23 12.45,64.1 12.45,70.32 16.18,74.05 18.67,74.05 v26.14,81.52 31.74,87.12 v31.74,96.46 | SJ1.2 36.72,53.52 37.34,53.52 37.96,52.9 37.96,50.41 36.72,49.16 34.23,49.16 33.6,49.78 26.14,49.78 17.42,58.5 17.42,60.36 J5.1
  Bottom 0.61: v26.14,81.52 32.98,81.52 SJ115.2 | v31.74,96.46 32.98,97.7 SJ117.2 | J5.2 J5.1 15.85,60.5 J5.6 15.84,63.27 J5.2
AGND
  Top 0.61: RN1.8 RN1.7 RN1.6 RN1.5 44.18,98.32 45.43,97.08 45.43,92.72 43.56,90.86 43.56,86.5 | RN2.8 RN2.7 RN2.6 RN2.5 43.56,83.39 43.56,86.5 | 41.69,46.05 40.35,47.4 U1.9 | 41.69,46.05 41.69,42.32 37.96,38.58 S1.3 S1.2 S1.1 37.34,32.98 32.98,32.98 31.11,31.11 17.42,31.11 J9.2 | 43.56,86.5 61.61,86.5 62.85,85.25 K1.A1 | 41.69,46.05 59.74,46.05 62.85,49.16 K8.A1
  Bottom 0.61: J5.7 14.46,64.77 | 14.46,64.77 J5.8 15.91,67.42 J5.3 | J5.3 16.02,64.77 14.46,64.77 | J9.3 J9.2 15.85,31.52 J9.7 15.84,34.29 J9.3 | U101.2 76.2,35.56 76.02,35.38 | 76.02,35.38 75.56,34.92 75.56,33.02 | 75.56,33.02 75.56,30.48 | 75.56,30.48 75.56,28.57 76.2,27.94 76.54,27.94 | 76.54,27.94 U101.8 | U101.6 75.56,30.48 | U101.4 75.56,33.02 | U100.2 76.54,21.59 | 76.54,21.59 76.2,21.59 75.56,20.95 75.56,19.05 | 75.56,19.05 75.56,16.51 | 75.56,16.51 75.56,14.61 76.2,13.97 U100.8 | U100.6 75.56,16.51 | U100.4 75.56,19.05 | K1.A1 K2.A1 K3.A1 K4.A1 K5.A1 K6.A1 K7.A1 K8.A1 63.48,49.16 75.92,36.72 75.92,35.47 76.02,35.38 | 23.02,47.94 32.98,47.94 34.85,46.08 34.85,40.45 IC100.10 | 23.02,47.94 19.29,44.21 19.29,36.72 17.42,34.85 J9.3 | 23.02,47.94 23.02,60.36 17.42,65.96 J5.3 | 76.54,27.94 76.54,21.59
COPPER
  pour Bottom: 0,17.78 0,1.27 arc90 1.27,0 98.73,0 arc90 100,1.27 100,98.73 arc90 98.73,100 1.27,100 arc90 0,98.73 0,82.55 5.08,82.55 arc-90 6.35,81.28 6.35,19.05 arc-90 5.08,17.78
  pour Top: 0,17.78 0,1.27 arc90 1.27,0 98.73,0 arc90 100,1.27 100,98.73 arc90 98.73,100 1.27,100 arc90 0,98.73 0,82.55 5.08,82.55 arc-90 6.35,81.28 6.35,19.05 arc-90 5.08,17.78
CS  (via drill 0.35)
  Top 0.305: v36.2,44.45 34.29,44.45 32.38,42.55 18.41,42.55 17.3,41.42 J9.5
  Bottom 0.305: IC100.11 v36.2,44.45
GND  (via drill 0.35)
  Top 0.61: LED1.C LED2.C LED3.C LED4.C | LED9.C LED10.C LED11.C LED12.C LED13.C LED14.C LED15.C | LED15.C LED16.C 26.14,3.73 24.89,2.49 19.29,2.49 15.56,6.22 v12.06,6.22 4.18,6.22 J12.10 | RN3.5 RN3.6 RN3.7 RN3.8 65.96,41.69 64.72,40.45 64.72,34.85 65.96,33.6 65.96,25.51 RN4.8 | RN4.8 RN4.7 RN4.6 RN4.5 | LED4.C LED5.C | LED4.C LED6.C | LED4.C LED7.C | LED4.C LED8.C 26.14,83.39 24.89,82.14 13.63,82.14 9.41,86.36 J1.10 | LED15.C 26.76,6.22 57.25,6.22 64.72,13.69 64.72,23.65 65.96,24.89 RN4.8
  Bottom 0.61: U102.2 32.98,71.12 | 32.98,71.12 33.02,71.12 33.66,71.75 33.66,73.66 | 33.66,73.66 33.66,76.2 | 33.66,76.2 33.66,78.11 33.02,78.74 U102.8 | U102.6 33.66,76.2 | U102.4 33.66,73.66 | 33.66,92.08 33.66,93.98 33.02,94.61 U103.8 31.74,94.59 27.38,98.95 8.89,98.95 7.79,97.84 7.79,86.36 | 33.66,92.08 33.66,89.53 | 33.66,89.53 33.66,87.63 33.02,87 U103.2 | U103.4 33.66,89.53 | U103.6 33.66,92.08 | J1.9 J1.10 7.79,86.36 | J12.9 J12.10 | 32.98,71.12 32.98,70.94 33.6,70.32 33.6,69.08 32.98,68.45 25.51,68.45 25.51,68.47 19.05,74.93 10.16,74.93 | 7.79,86.36 10.16,83.99 10.16,74.93 | v12.06,6.22 12.06,20.95 10.16,22.86 10.16,74.93
IN_1  (via drill 0.35)
  Top 0.305: v8.26,17.78 v19.05,17.78 19.68,17.14 R12.2
  Bottom 0.305: v19.05,17.78 19.68,17.14 41.91,17.14 43.18,18.41 43.18,40.64 44.32,41.78 SJ107.2 | J12.1 2.54,15.24 4.45,15.24 6.99,17.78 v8.26,17.78
IN_2  (via drill 0.35)
  Top 0.305: R13.2 19.68,15.24 v18.41,16.51 J12.2
  Bottom 0.305: v18.41,16.51 19.68,15.24 43.18,15.24 44.45,16.51 44.45,35.56 45.59,36.7 SJ106.2
IN_3  (via drill 0.35)
  Top 0.305: J12.3 2.54,15.24 v17.78,15.24 19.68,13.34 R14.2
  Bottom 0.305: v17.78,15.24 19.68,13.34 44.45,13.34 45.72,14.61 45.72,30.48 46.86,31.62 SJ105.2
IN_4  (via drill 0.35)
  Top 0.305: R15.2 19.68,11.43 v17.14,13.97 J12.4
  Bottom 0.305: v17.14,13.97 19.68,11.43 45.72,11.43 46.99,12.7 46.99,25.4 48.13,26.54 SJ104.2
IN_5  (via drill 0.35)
  Top 0.305: J12.5 2.54,12.7 v16.51,12.7 19.68,9.53 R16.2
  Bottom 0.305: v16.51,12.7 19.68,9.53 46.99,9.53 48.26,10.79 48.26,19.05 49.4,20.19 SJ103.2
IN_6  (via drill 0.35)
  Top 0.305: R17.2 19.68,7.62 v15.88,11.43 J12.6
  Bottom 0.305: v15.88,11.43 19.68,7.62 48.26,7.62 49.53,8.89 49.53,13.97 50.67,15.11 SJ102.2
IN_7  (via drill 0.35)
  Top 0.305: R18.2 19.68,5.71 v15.24,10.16 2.54,10.16 J12.7
  Bottom 0.305: v15.24,10.16 19.68,5.71 49.53,5.71 50.8,6.99 50.8,8.89 51.94,10.03 SJ101.2
IN_8  (via drill 0.35)
  Top 0.305: J12.8 v14.61,8.89 19.68,3.81 R19.2
  Bottom 0.305: SJ100.2 51.94,4.95 50.8,3.81 19.68,3.81 v14.61,8.89
INPUT_1  (via drill 0.35)
  Top 0.61: v32.38,29.21 33.66,27.94 36.83,27.94 38.1,26.67 38.1,17.78 39.37,16.51 43.81,16.51 45.09,17.78 45.09,43.18 46.35,44.45 v53.98,44.45
  Bottom 0.61: IC100.21 v32.38,29.21 | SJ107.1 56.39,44.45 v53.98,44.45
INPUT_2  (via drill 0.35)
  Top 0.61: v31.11,28.57 31.11,27.94 32.38,26.67 35.56,26.67 36.83,25.4 36.83,16.51 38.1,15.24 45.09,15.24 46.35,16.51 46.35,38.1 47.62,39.37 v56.52,39.37
  Bottom 0.61: IC100.22 v31.11,28.57 | SJ106.1 54.1,39.37 v56.52,39.37
INPUT_3  (via drill 0.35)
  Top 0.61: v29.84,27.94 29.84,26.67 31.11,25.4 34.29,25.4 35.56,24.13 35.56,15.24 36.83,13.97 46.35,13.97 47.62,15.24 47.62,33.02 48.9,34.29 v53.98,34.29
  Bottom 0.61: IC100.23 v29.84,27.94 | SJ105.1 56.39,34.29 v53.98,34.29
INPUT_4  (via drill 0.35)
  Top 0.61: v28.57,27.3 28.57,25.4 29.84,24.13 33.02,24.13 34.29,22.86 34.29,13.97 35.56,12.7 47.62,12.7 48.9,13.97 48.9,27.94 50.16,29.21 v56.52,29.21
  Bottom 0.61: IC100.24 v28.57,27.3 | SJ104.1 54.1,29.21 v56.52,29.21
INPUT_5  (via drill 0.35)
  Top 0.61: v27.3,26.67 27.3,24.13 28.57,22.86 31.75,22.86 33.02,21.59 33.02,12.7 34.29,11.43 48.9,11.43 50.16,12.7 50.16,21.59 51.44,22.86 v53.98,22.86
  Bottom 0.61: IC100.25 v27.3,26.67 | SJ103.1 56.39,22.86 v53.98,22.86
INPUT_6  (via drill 0.35)
  Top 0.61: v26.04,26.04 26.04,22.86 27.3,21.59 30.48,21.59 31.75,20.32 31.75,11.43 33.02,10.16 50.16,10.16 51.44,11.43 51.44,16.51 52.7,17.78 v56.52,17.78
  Bottom 0.61: IC100.26 v26.04,26.04 | SJ102.1 54.1,17.78 v56.52,17.78
INPUT_7  (via drill 0.35)
  Top 0.61: v24.77,25.4 24.77,21.59 26.04,20.32 29.21,20.32 30.48,19.05 30.48,10.16 31.75,8.89 51.44,8.89 52.7,10.16 52.7,11.43 v53.98,12.7
  Bottom 0.61: IC100.27 v24.77,25.4 | v53.98,12.7 56.39,12.7 SJ101.1
INPUT_8  (via drill 0.35)
  Top 0.61: v56.52,7.62 30.48,7.62 29.21,8.89 29.21,17.78 27.94,19.05 24.77,19.05 23.5,20.32 v23.5,24.77
  Bottom 0.61: v23.5,24.77 IC100.28 | v56.52,7.62 54.1,7.62 SJ100.1
MISO  (via drill 0.35)
  Top 0.305: v40.01,45.72 34.29,45.72 32.38,43.81 15.88,43.81 14.61,42.55 14.61,38.59 J9.9
  Bottom 0.305: IC100.14 v40.01,45.72
MOSI  (via drill 0.35)
  Top 0.305: v38.73,41.91 34.29,41.91 32.38,40.01 21.59,40.01 20.32,38.73 20.32,36.83 19.16,35.67 J9.8
  Bottom 0.305: IC100.13 v38.73,41.91
N$1
  Bottom 0.61: K3.A2 58.29,73.66 SJ113.3
N$2  (via drill 0.35)
  Top 0.61: RN1.3 v42.55,92.08
  Bottom 0.61: U103.11 v42.55,92.08 50.8,92.08 52.07,90.81 52.07,78.11 52.83,77.34 SJ114.2
N$3  (via drill 0.35)
  Top 0.61: RN1.4 v43.81,94.61
  Bottom 0.61: U103.9 v43.81,94.61 52.07,94.61 53.34,93.34 53.34,83.82 54.74,82.42 SJ116.2
N$4
  Bottom 0.61: K8.A2 58.29,48.26 SJ108.3
N$5
  Bottom 0.61: K7.A2 58.29,53.34 SJ109.3
N$6  (via drill 0.35)
  Top 0.61: RN2.3 v42.55,76.2
  Bottom 0.61: U102.11 v42.55,76.2 45.72,76.2 46.99,74.93 46.99,58.42 48.39,57.02 SJ110.2
N$7  (via drill 0.35)
  Top 0.61: RN2.4 v43.81,78.74
  Bottom 0.61: U102.9 v43.81,78.74 45.09,78.74 48.26,75.56 48.26,63.5 49.66,62.1 SJ111.2
N$8
  Bottom 0.61: K4.A2 58.29,68.58 SJ112.3
N$9
  Top 0.406: LED4.A R4.1
N$10
  Top 0.406: LED8.A R8.1
N$11  (via drill 0.35)
  Top 0.61: U1.1 v23.5,45.09
  Bottom 0.61: v23.5,45.09 IC100.1
N$12
  Top 0.406: R7.1 LED7.A
N$13  (via drill 0.35)
  Top 0.61: U1.3 v26.04,45.09
  Bottom 0.61: v26.04,45.09 IC100.3
N$14
  Top 0.406: LED6.A R6.1
N$15  (via drill 0.35)
  Top 0.61: v24.77,45.09 U1.2
  Bottom 0.61: IC100.2 v24.77,45.09
N$16
  Top 0.406: R5.1 LED5.A
N$17  (via drill 0.35)
  Top 0.61: v27.3,45.09 U1.4
  Bottom 0.61: IC100.4 v27.3,45.09
N$18
  Bottom 0.61: U102.1 30.11,69.85 29.48,70.48 R108.1
N$19
  Bottom 0.61: U102.3 30.11,72.39 29.48,73.03 R109.1
N$20
  Bottom 0.61: U102.5 30.11,74.93 29.48,75.56 R110.1
N$21
  Bottom 0.61: U102.7 30.11,77.47 29.48,78.11 R111.1
N$22
  Bottom 0.61: SJ115.3 34.92,77.47 | 34.92,77.47 34.92,74.93 | 34.92,74.93 34.92,72.39 | 34.92,72.39 34.92,70.48 35.56,69.85 U102.16 | U102.10 34.92,77.47 | U102.12 34.92,74.93 | U102.14 34.92,72.39
N$23  (via drill 0.35)
  Top 0.61: RN2.2 v41.27,73.66
  Bottom 0.61: U102.13 v41.27,73.66 44.45,73.66 45.72,72.39 45.72,53.34 47.12,51.94 SJ109.2
N$24
  Top 0.406: R3.1 LED3.A
N$25  (via drill 0.35)
  Top 0.61: RN2.1 v40.01,71.12
  Bottom 0.61: U102.15 v40.01,71.12 43.18,71.12 44.45,69.85 44.45,48.26 45.85,46.86 SJ108.2
N$26
  Bottom 0.61: SJ111.3 58.29,63.5 K5.A2
N$27
  Bottom 1.016: J4.1 84.9,69.37 K4.14
N$28
  Bottom 1.016: J4.2 86.48,72.87 K3.14
N$29
  Top 0.61: SJ1.3 34.92,52.07 33.66,53.34 U1.10
N$30
  Top 0.305: R12.1 LED9.A
N$31
  Top 0.305: LED10.A R13.1
N$32
  Top 0.305: R14.1 LED11.A
N$33
  Bottom 1.016: J3.1 86.37,77.94 84.49,79.82 K2.14
N$34
  Top 0.305: LED12.A R15.1
N$35
  Bottom 0.61: R107.1 79.75,36.83 U101.1
N$36
  Bottom 0.61: R106.1 79.75,34.29 U101.3
N$37
  Top 0.406: LED2.A R2.1
N$38
  Top 0.406: R1.1 LED1.A
N$39
  Bottom 1.016: J3.2 88.07,81.44 K1.14
N$40
  Bottom 1.016: K8.11 K7.11 K6.11 K5.11 81.92,67.12 81.92,87 83.82,88.9 89.06,88.9 90.18,87.78 J2.1
N$41
  Bottom 0.61: R112.1 29.48,86.36 30.11,85.72 U103.1
N$42
  Bottom 1.016: J7.1 85.98,52.23 84.49,50.73 K8.14
N$43
  Bottom 0.61: J8.1 87.17,32.38 R106.2
N$44
  Bottom 1.016: K4.11 K3.11 K2.11 K1.11 79.49,88.38 82.55,91.44 93.95,91.44 J2.2
N$45
  Bottom 0.61: K6.A2 58.29,58.42 SJ110.3
N$46
  Bottom 1.016: J7.2 85.67,55.73 K7.14
N$47
  Bottom 1.016: J6.1 85.67,60.8 K6.14
N$48
  Bottom 0.61: K2.A2 58.29,78.74 SJ114.3
N$49
  Bottom 0.61: U103.3 30.11,88.27 29.48,88.9 R113.1
N$50
  Bottom 0.61: U103.5 30.11,90.81 29.48,91.44 R114.1
N$51
  Bottom 0.61: U103.7 30.11,93.34 29.48,93.98 R115.1
N$52
  Bottom 0.61: U103.10 34.92,93.34 | SJ117.3 34.92,93.34 | 34.92,93.34 34.92,90.81 | 34.92,90.81 34.92,88.27 | 34.92,88.27 34.92,86.36 35.56,85.72 U103.16 | U103.14 34.92,88.27 | U103.12 34.92,90.81
N$53  (via drill 0.35)
  Top 0.61: RN1.2 v41.27,89.53
  Bottom 0.61: U103.13 v41.27,89.53 49.53,89.53 50.8,88.27 50.8,73.66 52.2,72.26 SJ113.2
N$54  (via drill 0.35)
  Top 0.61: RN1.1 v40.01,87
  Bottom 0.61: U103.15 v40.01,87 48.26,87 49.53,85.72 49.53,68.58 50.93,67.18 SJ112.2
N$55
  Bottom 0.61: K1.A2 58.29,83.82 SJ116.3
N$56
  Bottom 0.61: J13.2 92.69,15.88 R101.2
N$57
  Bottom 1.016: J6.2 84.89,64.3 K5.14
N$58  (via drill 0.35)
  Top 0.61: U1.5 v28.57,45.09
  Bottom 0.61: v28.57,45.09 IC100.5
N$61  (via drill 0.35)
  Top 0.61: U1.7 v31.11,45.09
  Bottom 0.61: v31.11,45.09 IC100.7
N$64  (via drill 0.35)
  Top 0.61: v29.84,45.09 U1.6
  Bottom 0.61: IC100.6 v29.84,45.09
N$65  (via drill 0.35)
  Top 0.61: v32.38,45.09 U1.8
  Bottom 0.61: IC100.8 v32.38,45.09
N$73
  Bottom 0.61: R105.1 79.75,31.75 U101.5
N$74  (via drill 0.35)
  Top 0.61: R9.1 S1.4 v31.11,38.1
  Bottom 0.61: IC100.15 40.01,36.83 38.73,38.1 v31.11,38.1
N$75  (via drill 0.35)
  Top 0.61: v31.11,35.56 S1.5 R10.1
  Bottom 0.61: v31.11,35.56 37.47,35.56 38.73,34.29 IC100.16
N$76  (via drill 0.35)
  Top 0.61: R11.1 S1.6 v31.11,33.02
  Bottom 0.61: IC100.17 37.47,31.75 36.2,33.02 v31.11,33.02
N$77
  Bottom 0.61: R104.1 79.75,29.21 U101.7
N$78
  Top 0.305: R16.1 LED13.A
N$79  (via drill 0.35)
  Top 0.61: RN3.2 v67.31,33.02
  Bottom 0.61: U101.13 v67.31,33.02 64.14,33.02 59.05,38.1 SJ106.3
N$80  (via drill 0.35)
  Top 0.61: RN3.1 v66.04,35.56
  Bottom 0.61: SJ107.3 57.78,43.18 65.41,35.56 v66.04,35.56 U101.15
N$81
  Top 0.305: LED14.A R17.1
N$82
  Top 0.305: R18.1 LED15.A
N$83
  Top 0.305: LED16.A R19.1
N$85
  Bottom 0.61: R103.1 79.75,22.86 U100.1
N$86
  Bottom 0.61: R102.1 79.75,20.32 U100.3
N$87
  Bottom 0.61: R101.1 79.75,17.78 U100.5
N$88
  Bottom 0.61: R100.1 79.75,15.24 U100.7
N$89  (via drill 0.35)
  Top 0.61: RN4.2 v67.31,19.05
  Bottom 0.61: U100.13 v67.31,19.05 62.87,19.05 60.33,16.51 SJ102.3
N$90  (via drill 0.35)
  Top 0.61: RN4.1 v66.04,21.59
  Bottom 0.61: SJ103.3 v66.04,21.59 U100.15
N$91  (via drill 0.35)
  Top 0.61: RN4.3 v68.58,16.51
  Bottom 0.61: U100.11 v68.58,16.51 64.14,16.51 59.05,11.43 SJ101.3
N$92  (via drill 0.35)
  Top 0.61: RN4.4 v69.85,13.97
  Bottom 0.61: SJ100.3 57.78,6.35 65.41,13.97 v69.85,13.97 U100.9
N$93
  Bottom 0.61: R107.2 87.42,38.9 J8.2
N$95
  Bottom 0.61: J10.2 94.9,29.84 R105.2
N$96
  Bottom 0.61: J10.1 89.7,27.3 R104.2
N$97  (via drill 0.35)
  Top 0.61: RN3.3 v68.58,30.48
  Bottom 0.61: U101.11 v68.58,30.48 62.87,30.48 60.33,33.02 SJ105.3
N$98  (via drill 0.35)
  Top 0.61: RN3.4 v69.85,27.94
  Bottom 0.61: U101.9 v69.85,27.94 SJ104.3
N$99
  Bottom 0.61: R103.2 94.58,20.95 J11.2
N$100
  Bottom 0.61: J11.1 90.02,18.41 R102.2
N$101
  Bottom 0.61: J13.1 86.53,13.34 R100.2
OUT_1  (via drill 0.35)
  Top 0.305: J1.1 2.54,97.79 v19.05,97.79 19.68,97.16 R1.2
  Bottom 0.305: v19.05,97.79 22.86,93.98 R115.2
OUT_2  (via drill 0.35)
  Top 0.305: J1.2 v18.41,96.52 19.68,95.25 R2.2
  Bottom 0.305: R114.2 23.5,91.44 v18.41,96.52
OUT_3  (via drill 0.35)
  Top 0.305: R3.2 19.68,93.34 v17.78,95.25 2.54,95.25 J1.3
  Bottom 0.305: R113.2 24.13,88.9 v17.78,95.25
OUT_4  (via drill 0.35)
  Top 0.305: J1.4 v17.14,93.98 19.68,91.44 R4.2
  Bottom 0.305: R112.2 24.77,86.36 v17.14,93.98
OUT_5  (via drill 0.35)
  Top 0.305: J1.5 2.54,92.71 v16.51,92.71 19.68,89.53 R5.2
  Bottom 0.305: R111.2 25.4,78.11 24.77,78.74 24.77,84.45 v16.51,92.71
OUT_6  (via drill 0.35)
  Top 0.305: J1.6 v15.88,91.44 19.68,87.63 R6.2
  Bottom 0.305: v15.88,91.44 23.5,83.82 23.5,77.47 25.4,75.56 R110.2
OUT_7  (via drill 0.35)
  Top 0.305: J1.7 2.54,90.17 v15.24,90.17 19.68,85.72 R7.2
  Bottom 0.305: v15.24,90.17 22.23,83.19 22.23,76.2 25.4,73.03 R109.2
OUT_8  (via drill 0.35)
  Top 0.305: J1.8 v14.61,88.9 19.68,83.82 R8.2
  Bottom 0.305: v14.61,88.9 20.95,82.55 20.95,74.93 25.4,70.48 R108.2
OUTPUT_1  (via drill 0.35)
  Top 0.61: U1.18 23.5,67.94 24.77,69.22 43.81,69.22 45.09,70.48 45.09,83.82 46.35,85.09 v54.61,85.09
  Bottom 0.61: SJ116.1 56.39,85.09 v54.61,85.09
OUTPUT_2  (via drill 0.35)
  Top 0.61: U1.17 24.77,66.67 26.04,67.94 45.09,67.94 46.35,69.22 46.35,78.74 47.62,80.01 v56.52,80.01
  Bottom 0.61: v56.52,80.01 54.1,80.01 SJ114.1
OUTPUT_3  (via drill 0.35)
  Top 0.61: U1.16 26.04,65.41 27.3,66.67 46.35,66.67 47.62,67.94 47.62,73.66 48.9,74.93 v53.98,74.93
  Bottom 0.61: v53.98,74.93 56.39,74.93 SJ113.1
OUTPUT_4  (via drill 0.35)
  Top 0.61: U1.15 27.3,64.14 28.57,65.41 47.62,65.41 48.9,66.67 48.9,68.58 50.16,69.85 v56.52,69.85
  Bottom 0.61: v56.52,69.85 54.1,69.85 SJ112.1
OUTPUT_5  (via drill 0.35)
  Top 0.61: U1.14 28.57,62.87 29.84,64.14 48.9,64.14 49.53,64.77 v53.98,64.77
  Bottom 0.61: v53.98,64.77 56.39,64.77 SJ111.1
OUTPUT_6  (via drill 0.35)
  Top 0.61: U1.13 29.84,61.59 31.11,62.87 47.62,62.87 48.9,61.59 48.9,60.96 50.16,59.69 v56.52,59.69
  Bottom 0.61: v56.52,59.69 54.1,59.69 SJ110.1
OUTPUT_7  (via drill 0.35)
  Top 0.61: U1.12 31.11,60.33 32.38,61.59 46.35,61.59 47.62,60.33 47.62,55.88 48.9,54.61 v53.98,54.61
  Bottom 0.61: v53.98,54.61 56.39,54.61 SJ109.1
OUTPUT_8  (via drill 0.35)
  Top 0.61: U1.11 32.38,59.05 33.66,60.33 45.09,60.33 46.35,59.05 46.35,50.8 47.62,49.53 v56.52,49.53
  Bottom 0.61: v56.52,49.53 54.1,49.53 SJ108.1
SCK  (via drill 0.35)
  Top 0.305: v37.47,43.18 34.29,43.18 32.38,41.27 20.32,41.27 19.05,40.01 19.05,38.1 18.01,37.06 J9.4
  Bottom 0.305: IC100.12 v37.47,43.18
VCC
  Bottom 0.61: J1.11 J1.12 6.35,83.82 7.62,82.55 7.62,22.23 10.16,19.68 10.16,3.73 | J12.11 J12.12 4.18,3.73 10.16,3.73 | U101.16 73.66,36.83 74.3,36.2 74.3,34.29 | 74.3,34.29 74.3,31.75 | 74.3,31.75 74.3,29.84 73.66,29.21 73.43,29.21 | 73.43,29.21 U101.10 | U101.12 74.3,31.75 | U101.14 74.3,34.29 | U100.10 73.66,15.24 74.02,15.6 | 74.02,15.6 74.3,15.88 74.3,17.78 | 74.3,17.78 74.3,20.32 | 74.3,20.32 74.3,22.23 73.66,22.86 | 73.66,22.86 U100.16 | U100.14 74.3,20.32 | U100.12 74.3,17.78 | 10.16,3.73 18.05,3.73 19.29,2.49 56.01,2.49 65.96,12.45 72.81,12.45 74.05,13.69 74.05,15.56 74.02,15.6 | 73.43,29.21 73.43,23.02 73.66,22.86
VCCA  (via drill 0.35)
  Top 0.61: R9.2 R10.2 R11.2 24.27,32.98 v23.02,32.98 | SJ1.1 36.09,51.03 26.76,51.03 19.29,58.5 19.29,66.81 J5.4 | 36.72,81.52 28,81.52 18.06,71.58 J5.5 | 36.72,81.52 v37.96,81.52 | 36.72,81.52 v36.72,95.83
  Bottom 0.61: J5.5 15.85,71.58 J5.9 15.84,68.81 J5.4 18.93,68.81 24.77,62.98 24.77,50.8 26.04,49.53 40.01,49.53 41.69,47.84 41.69,46.05 41.69,45.72 41.69,30.49 40.45,29.25 36.72,29.25 36.09,29.87 | v37.96,81.52 36.72,81.52 SJ115.1 | v36.72,95.83 36.72,97.7 SJ117.1 | 36.09,29.87 36.09,30.49 IC100.18 | 21.78,31.74 v23.02,32.98 | 21.78,31.74 21.78,24.27 23.02,23.02 29.25,23.02 36.09,29.87 | IC100.9 33.66,45.09 32.38,46.35 23.5,46.35 21.78,44.64 21.78,31.74

### Text on the board
tPlace: OUTPUT_[0] | OUTPUT_[1] | OUTPUT_[2] | OUTPUT_[3] | OUTPUT_[4] | OUTPUT_[5] | - | OUTPUT_[6] | + | OUTPUT_[7] | 5V 24V | Slave Address Select | SCADA - Digital I/O Board | REV: A | Design: L.E. Fdez | INPUT_[0] | INPUT_[1] | INPUT_[2] | INPUT_[3] | INPUT_[4] | INPUT_[5] | - | INPUT_[6] | INPUT_[7] | +
bPlace: 5V 24V | COM_[0] | COM_[1] | 5V 24V | IO SPI | OUT_[0] | OUT_[1] | IO SPI | OUT_[2] | IO SPI | 5V | OUT_[3] | IO SPI | GND | OUT_[4] | IO SPI | 24V | OUT_[5] | IO SPI | OUT_[6] | OUT_[7] | IO SPI | IO SPI | IO SPI | IN_[0] | SPI | IO SPI | IN_[1] | GND | IO SPI | IN_[2] | CAN | IN_[3] | IO SPI | IN_[4] | IO SPI | IN_[5] | IO SPI | IN_[6] | IO SPI | IN_[7] | Universidad Autónoma / de Querétaro | IO SPI